# EAGLE design Rpi board 1 (EAGLE 7.3.0)
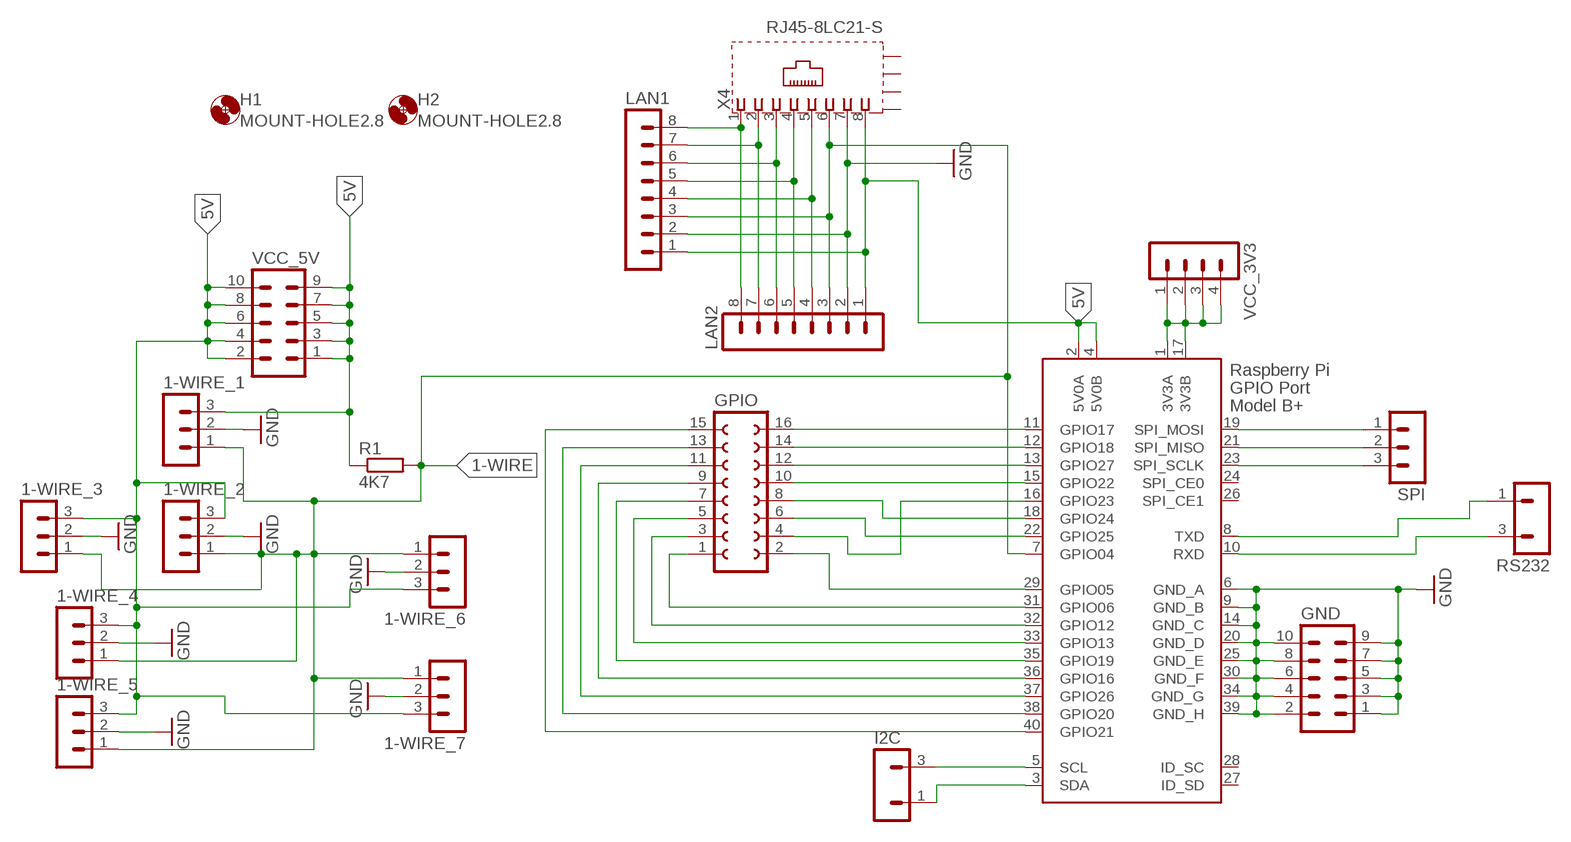
[diagram p0: schematic, sheet 1]

## Parts
1-WIRE_1  MA03-1  [MA03-1]
1-WIRE_2  MA03-1  [MA03-1]
1-WIRE_3  MA03-1  [MA03-1]
1-WIRE_4  MA03-1  [MA03-1]
1-WIRE_5  MA03-1  [MA03-1]
1-WIRE_6  MA03-1  [MA03-1]
1-WIRE_7  MA03-1  [MA03-1]
GND  MA05-2  [MA05-2]
GPIO  FE08-2  [FE08-2]
H1  MOUNT-HOLE2.8  [2,8]
H2  MOUNT-HOLE2.8  [2,8]
I2C  MA03-1  [MA03-1]
LAN1  MA08-1  [MA08-1]
LAN2  MA08-1  [MA08-1]
R1  4K7  R-EU_M0805  [M0805]
RS232  MA03-1  [MA03-1]
SPI  MA03-1  [MA03-1]
VCC_3V3  MA04-1  [MA04-1]
VCC_5V  MA05-2  [MA05-2]
X1  RASPI_GPIO_B+#_BOX  [RASPI_GPIO_B+_BOX]
X4  RJ45-8LC21-S  [RJ45-SHIELD1]

## Nets
1-WIRE: 1-WIRE_1.1 1-WIRE_2.1 1-WIRE_3.1 1-WIRE_4.1 1-WIRE_5.1 1-WIRE_6.1 1-WIRE_7.1 LAN1.3 LAN2.3 R1.2 X1.7(GPIO04) X4.6
5V: 1-WIRE_1.3 1-WIRE_2.3 1-WIRE_3.3 1-WIRE_4.3 1-WIRE_5.3 1-WIRE_6.3 1-WIRE_7.3 LAN1.1 LAN2.1 R1.1 VCC_5V.1 VCC_5V.2 VCC_5V.3 VCC_5V.4 VCC_5V.5 VCC_5V.6 VCC_5V.7 VCC_5V.8 VCC_5V.9 VCC_5V.10 X1.2(5V0A) X1.4(5V0B) X4.8
GND: 1-WIRE_1.2 1-WIRE_2.2 1-WIRE_3.2 1-WIRE_4.2 1-WIRE_5.2 1-WIRE_6.2 1-WIRE_7.2 GND.1 GND.2 GND.3 GND.4 GND.5 GND.6 GND.7 GND.8 GND.9 GND.10 LAN1.2 LAN2.2 X1.6(GND_A) X1.9(GND_B) X1.14(GND_C) X1.20(GND_D) X1.25(GND_E) X1.30(GND_F) X1.34(GND_G) X1.39(GND_H) X4.7
N$1: RS232.1 X1.8(TXD)
N$2: VCC_3V3.1 VCC_3V3.2 VCC_3V3.3 VCC_3V3.4 X1.1(3V3A) X1.17(3V3B)
N$3: RS232.3 X1.10(RXD)
N$4: SPI.1 X1.19(SPI_MOSI)
N$5: SPI.2 X1.21(SPI_MISO)
N$6: SPI.3 X1.23(SPI_SCLK)
N$7: I2C.3 X1.5(SCL)
N$8: I2C.1 X1.3(SDA)
N$9: GPIO.16 X1.11(GPIO17)
N$10: GPIO.14 X1.12(GPIO18)
N$11: GPIO.12 X1.13(GPIO27)
N$12: GPIO.10 X1.15(GPIO22)
N$13: GPIO.8 X1.18(GPIO24)
N$14: GPIO.6 X1.22(GPIO25)
N$15: GPIO.4 X1.16(GPIO23)
N$16: GPIO.2 X1.29(GPIO05)
N$17: GPIO.1 X1.31(GPIO06)
N$18: GPIO.3 X1.32(GPIO12)
N$19: GPIO.5 X1.33(GPIO13)
N$20: GPIO.7 X1.35(GPIO19)
N$21: GPIO.9 X1.36(GPIO16)
N$22: GPIO.11 X1.37(GPIO26)
N$23: GPIO.13 X1.38(GPIO20)
N$24: GPIO.15 X1.40(GPIO21)
N$28: LAN1.4 LAN2.4 X4.5
N$29: LAN1.5 LAN2.5 X4.4
N$30: LAN1.6 LAN2.6 X4.3
N$31: LAN1.7 LAN2.7 X4.2
N$32: LAN1.8 LAN2.8 X4.1
Unconnected: X1.24(SPI_CE0) X1.26(SPI_CE1) X1.27(ID_SD) X1.28(ID_SC) X4.S1(S) X4.S2(S) X4.S3(S) X4.S4(S)

## Library data of the parts
1-WIRE_1-1-WIRE_7 SPI = con-lstb:MA03-1: PIN HEADER; OC_FARNELL: unknown; OC_NEWARK: unknown
GND VCC_5V = con-lstb-wachcio:MA05-2: PIN HEADER; OC_FARNELL: unknown; OC_NEWARK: unknown
GPIO = con-lsta:FE08-2: FEMALE HEADER; OC_FARNELL: unknown; OC_NEWARK: unknown
H1 H2 = holes:MOUNT-HOLE: MOUNTING HOLE with drill center marker
I2C RS232 = con-lstb-wachcio:MA03-1: PIN HEADER; OC_FARNELL: unknown; OC_NEWARK: unknown
LAN1 LAN2 = con-lstb:MA08-1: PIN HEADER; OC_FARNELL: unknown; OC_NEWARK: unknown
R1 = rcl:R-EU_: RESISTOR, European symbol
VCC_3V3 = con-lstb-wachcio:MA04-1: PIN HEADER; OC_FARNELL: unknown; OC_NEWARK: unknown
X1 = raspberrypi_bastelstube_v13:RASPI_GPIO_B+#: 2x20 header connector, all pins connected
X4 = con-tycoelectronics:RJ45*2: RJ45 Low Profile Shield Type 2 For all RJ45 L, LC, LCT and X Series Models Source: www.tycoelectronics.com .. ENG_DS_1654001_1099_RJ_L_0507.pdf; OC_FARNELL: unknown; OC_NEWARK: unknown

## Board
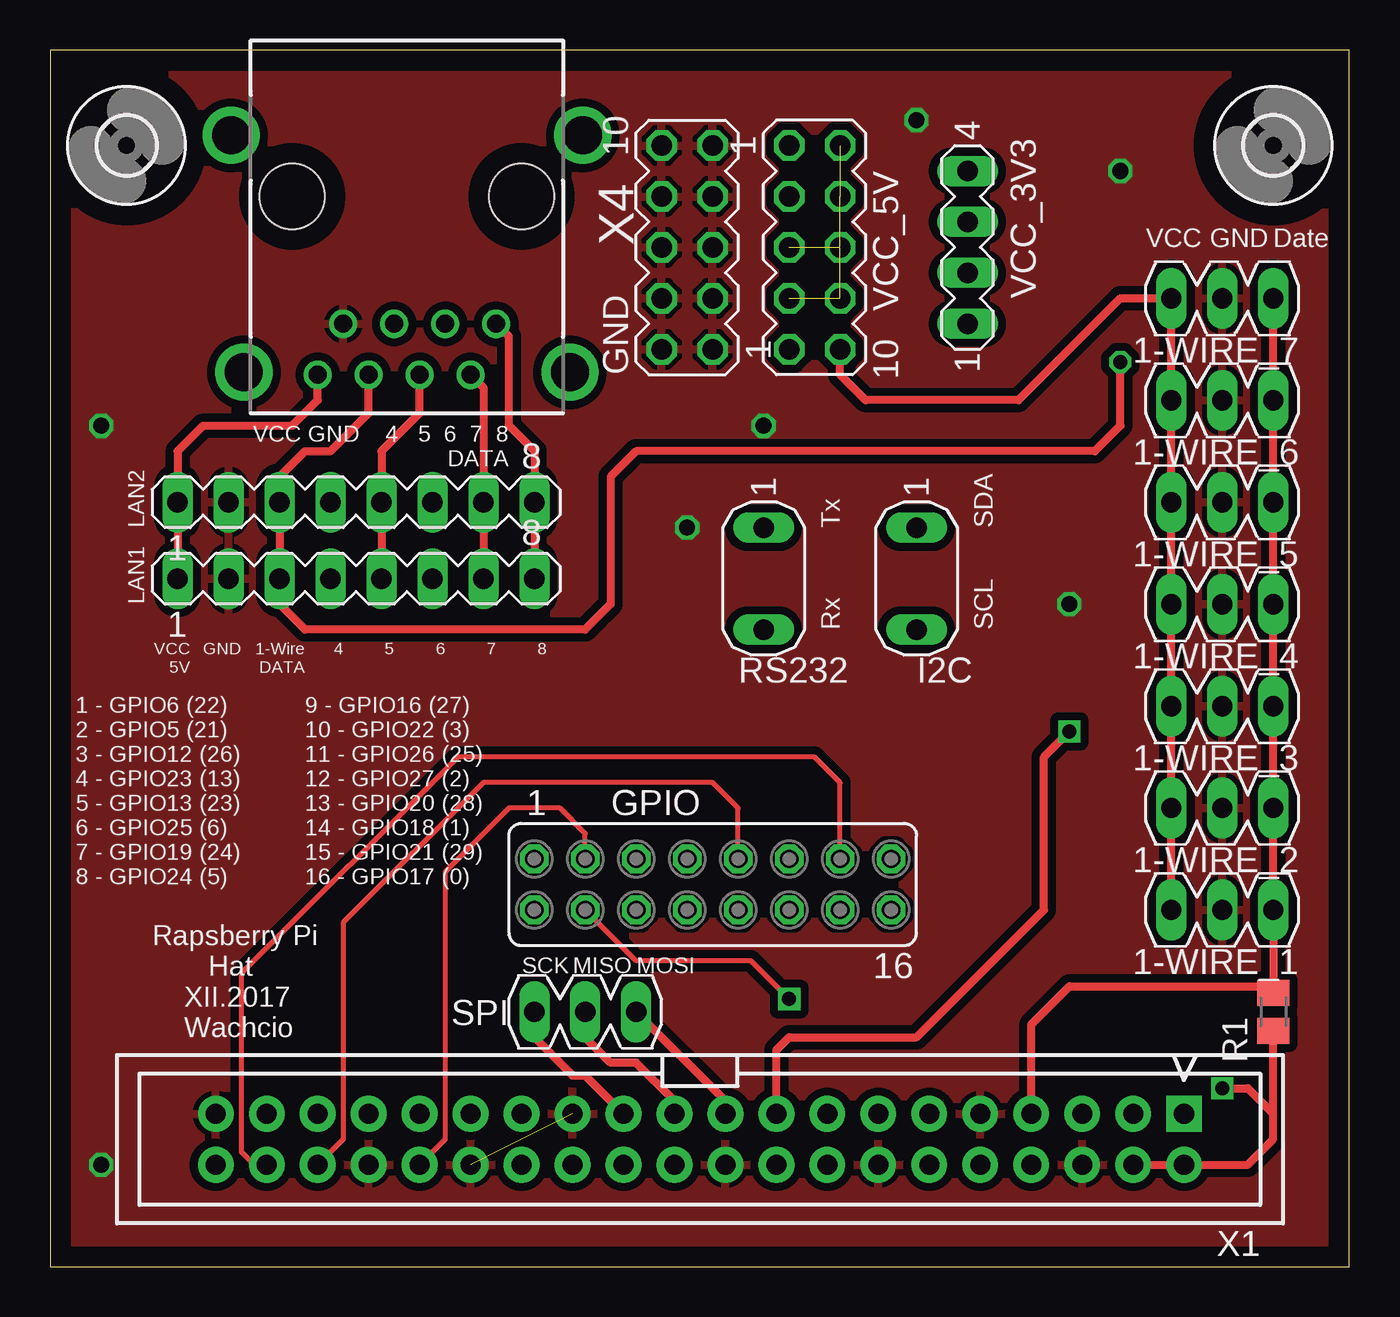
[diagram p1: board, top side]
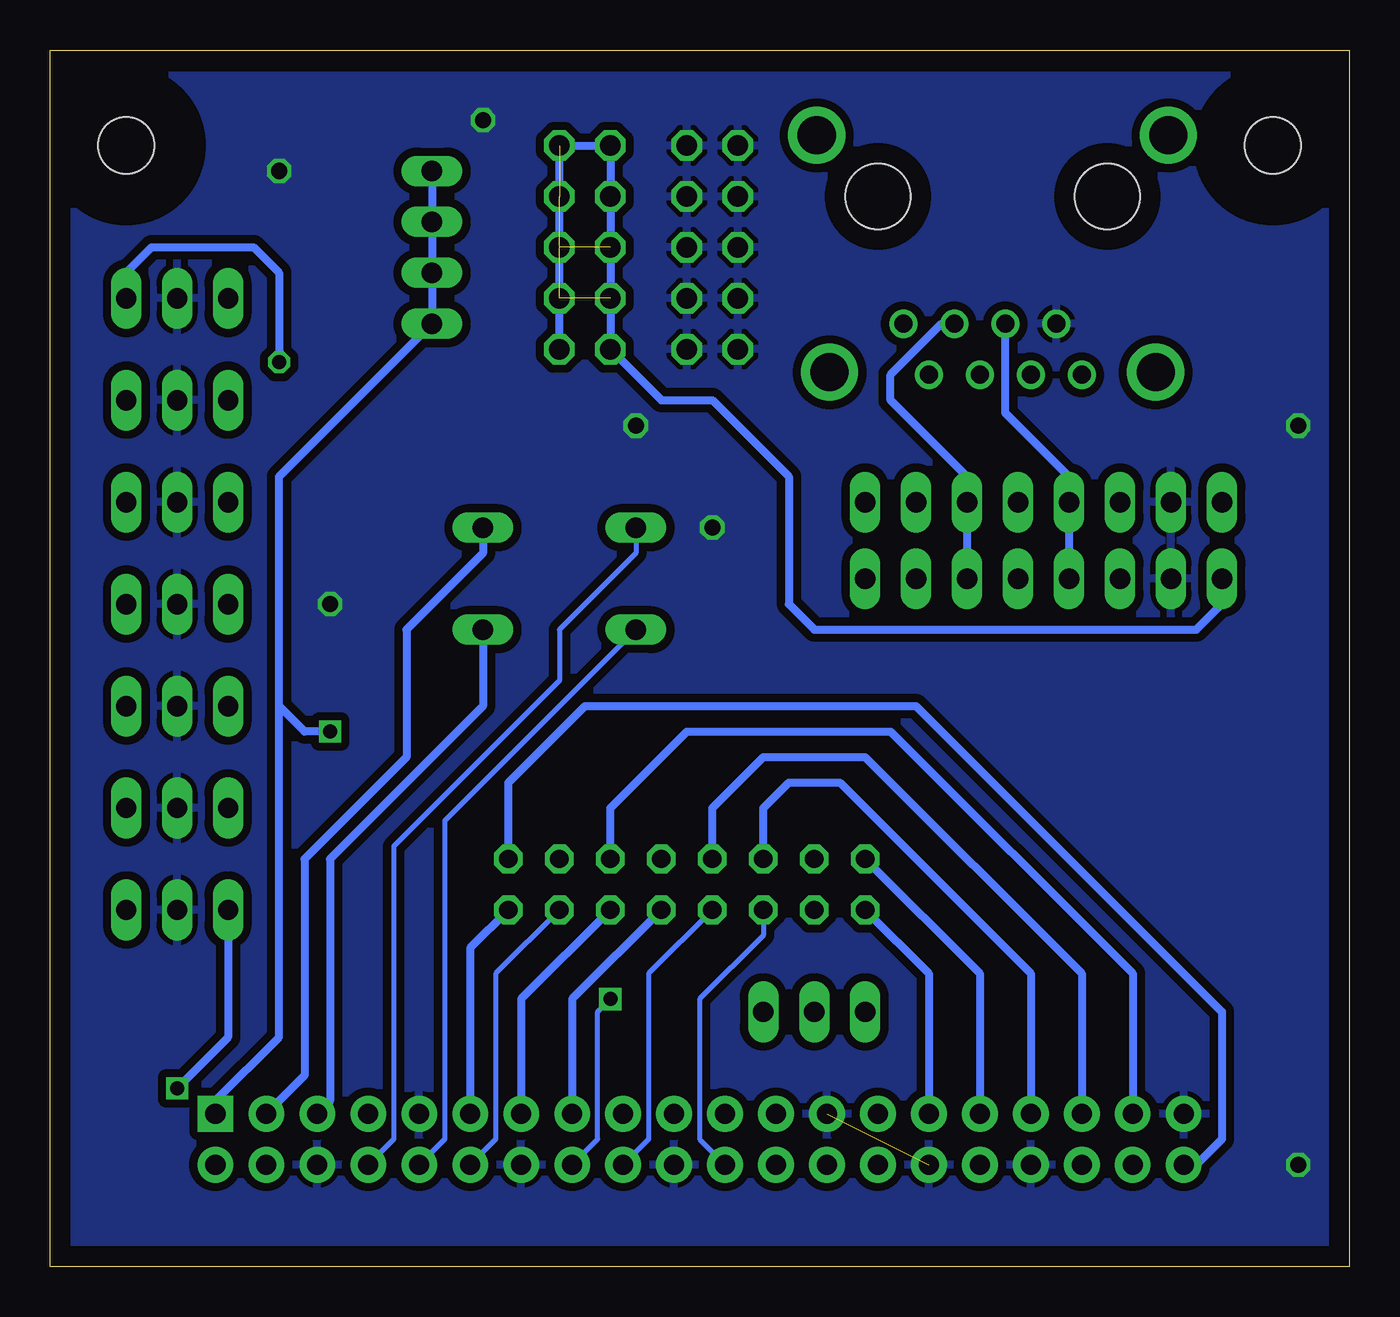
[diagram p2: board, bottom side, seen from below]

Size 64.75 x 60.63 mm. Coordinates in mm from the lower left corner, seen from the top.
Outline: 0,0 64.75,0 64.75,60.63 0,60.63 0,0
Copper layers (1*16): Top 0.035mm / dielectric 1.5mm / Bottom 0.035mm
Design rules "default": minimum track width 10mil, minimum drill 24mil, track to track 8mil, track to pad 8mil, pad to pad 8mil, via to via 8mil, smd to smd 8mil, copper to edge 40mil, drill to drill 8mil, minimum pad ring 10mil, minimum via ring 8mil, stop-mask expansion 4mil, vias tented up to drill 0mil, thermal gap 10mil

### Footprints (pad centres in the part's own frame; a part is rotated, then mirrored left to right if it is on the bottom)
MA03-1 = drill 1.016 long: 1 -2.54,0; 2 0,0; 3 2.54,0
MA05-2 = drill 1.016 octagon: 1 -5.08,-1.27; 2 -5.08,1.27; 3 -2.54,-1.27; 4 -2.54,1.27; 5 0,-1.27; 6 0,1.27; 7 2.54,-1.27; 8 2.54,1.27; 9 5.08,-1.27; 10 5.08,1.27
FE08-2 = drill 0.914 octagon: 1 -8.89,1.27; 2 -8.89,-1.27; 3 -6.35,1.27; 4 -6.35,-1.27; 5 -3.81,1.27; 6 -3.81,-1.27; 7 -1.27,1.27; 8 -1.27,-1.27; 9 1.27,1.27; 10 1.27,-1.27; 11 3.81,1.27; 12 3.81,-1.27; 13 6.35,1.27; 14 6.35,-1.27; 15 8.89,1.27; 16 8.89,-1.27
2,8 = hole 2.8: 0,0
MA03-1' = drill 1.016 long: 1 -2.54,0; 3 2.54,0
MA08-1 = drill 1.016 long: 1 -8.89,0; 2 -6.35,0; 3 -3.81,0; 4 -1.27,0; 5 1.27,0; 6 3.81,0; 7 6.35,0; 8 8.89,0
M0805 = smd 1.3 x 1.6: 1 -0.95,0; 2 0.95,0
MA04-1 = drill 1.016 long: 1 -3.81,0; 2 -1.27,0; 3 1.27,0; 4 3.81,0
RASPI_GPIO_B+_BOX = drill 1 pad 1.778 square: 1 -24.13,-1.27 | drill 1 pad 1.778: 2 -24.13,1.27; 3 -21.59,-1.27; 4 -21.59,1.27; 5 -19.05,-1.27; 6 -19.05,1.27; 7 -16.51,-1.27; 8 -16.51,1.27; 9 -13.97,-1.27; 10 -13.97,1.27; 11 -11.43,-1.27; 12 -11.43,1.27; 13 -8.89,-1.27; 14 -8.89,1.27; 15 -6.35,-1.27; 16 -6.35,1.27; 17 -3.81,-1.27; 18 -3.81,1.27; 19 -1.27,-1.27; 20 -1.27,1.27; 21 1.27,-1.27; 22 1.27,1.27; 23 3.81,-1.27; 24 3.81,1.27; 25 6.35,-1.27; 26 6.35,1.27; 27 8.89,-1.27; 28 8.89,1.27; 29 11.43,-1.27; 30 11.43,1.27; 31 13.97,-1.27; 32 13.97,1.27; 33 16.51,-1.27; 34 16.51,1.27; 35 19.05,-1.27; 36 19.05,1.27; 37 21.59,-1.27; 38 21.59,1.27; 39 24.13,-1.27; 40 24.13,1.27
RJ45-SHIELD1 = drill 0.9 pad 1.4: 1 -4.445,6.35; 2 -3.175,8.89; 3 -1.905,6.35; 4 -0.635,8.89; 5 0.635,6.35; 6 1.905,8.89; 7 3.175,6.35; 8 4.445,8.89 | drill 1.9 pad 2.5: S1 -8.763,-3.048; S2 8.763,-3.048; S3 -8.128,8.76; S4 8.128,8.76 | hole 3.251: -5.715,0; 5.715,0

### Placement (x,y rotation side)
1-WIRE_1  58.42,17.78 180 top
1-WIRE_2  58.42,22.86 180 top
1-WIRE_3  58.42,27.94 180 top
1-WIRE_4  58.42,33.02 180 top
1-WIRE_5  58.42,38.1 180 top
1-WIRE_6  58.42,43.18 180 top
1-WIRE_7  58.42,48.26 180 top
GND  31.75,50.8 90 top
GPIO  33.02,19.05 0 top
H1  60.96,55.88 0 top
H2  3.81,55.88 0 top
I2C  [MA03-1']  43.18,34.29 270 top
LAN1  15.24,34.29 0 top
LAN2  15.24,38.1 0 top
R1  60.96,12.7 90 top
RS232  [MA03-1']  35.56,34.29 270 top
SPI  26.67,12.7 180 top
VCC_3V3  45.72,50.8 90 top
VCC_5V  38.1,50.8 270 top
X1  32.38,6.35 180 top
X4  17.78,53.34 180 top

### Tracks (layer width: path | path; a pad name or v marks a point on that pad's centre or on a via)
1-WIRE  (via drill 0.7)
  Top 0.406: v53.34,45.09 53.34,41.91 52.07,40.64 29.21,40.64 27.94,39.37 27.94,33.02 26.67,31.75 12.7,31.75 11.43,33.02 LAN1.3 LAN2.3 11.43,39.37 12.7,40.64 13.97,40.64 15.88,42.55 X4.6 | 1-WIRE_7.1 1-WIRE_6.1 1-WIRE_5.1 1-WIRE_4.1 1-WIRE_3.1 1-WIRE_2.1 1-WIRE_1.1 R1.2 60.64,13.97 50.8,13.97 48.9,12.06 X1.7
  Bottom 0.406: 1-WIRE_7.1 60.96,49.53 59.69,50.8 54.61,50.8 53.34,49.53 v53.34,45.09
5V  (via drill 0.7)  (5 unrouted)
  Top 0.406: VCC_5V.10 39.37,44.45 40.64,43.18 48.26,43.18 53.34,48.26 1-WIRE_7.3 1-WIRE_6.3 1-WIRE_5.3 1-WIRE_4.3 1-WIRE_3.3 1-WIRE_2.3 1-WIRE_1.3 | X1.4 X1.2 59.69,5.08 60.96,6.35 60.96,7.62 | 60.96,7.62 R1.1 | v58.42,8.89 59.69,8.89 60.96,7.62 | X4.8 13.34,43.18 12.06,41.91 7.62,41.91 6.35,40.64 LAN2.1 LAN1.1
  Bottom 0.406: VCC_5V.10 VCC_5V.2 VCC_5V.1 VCC_5V.3 VCC_5V.9 34.29,43.18 31.75,43.18 27.94,39.37 27.94,33.02 26.67,31.75 7.62,31.75 6.35,33.02 LAN1.1 | 1-WIRE_1.3 55.88,11.43 v58.42,8.89
GND  (via drill 0.8)  (1 unrouted)
  other vias: 31.75,36.83 2.54,41.91 53.34,54.61 2.54,5.08 35.56,41.91 50.8,33.02 43.18,57.15
  pour Bottom (isolate 0.406): 0,0 64.77,0 64.77,59.69 0,59.69
  pour Top (isolate 0.406): 0,0 64.77,0 64.77,59.69 0,59.69
N$1
  Bottom 0.254: RS232.1 35.56,35.56 39.37,31.75 39.37,29.21 47.62,20.95 47.62,6.35 X1.8
N$2  (via drill 0.7)
  Top 0.406: X1.17 36.2,10.79 36.83,11.43 43.18,11.43 49.53,17.78 49.53,25.4 v50.8,26.67
  Bottom 0.406: VCC_3V3.4 VCC_3V3.3 VCC_3V3.2 VCC_3V3.1 53.34,39.37 53.34,27.94 | X1.1 56.52,8.26 53.34,11.43 53.34,27.94 | 53.34,27.94 52.07,26.67 v50.8,26.67
N$3
  Bottom 0.254: RS232.3 45.09,22.23 45.09,6.35 X1.10
N$4
  Top 0.406: X1.19 33.66,8.26 SPI.1
N$5
  Top 0.406: X1.21 31.11,8.26 29.21,10.16 27.94,10.16 26.67,11.43 SPI.2
N$6
  Top 0.406: SPI.3 24.13,11.43 26.04,9.53 26.67,9.53 X1.23
N$7
  Bottom 0.406: I2C.3 43.18,27.94 50.8,20.32 50.8,8.26 X1.5
N$8
  Bottom 0.406: I2C.1 43.18,35.56 46.99,31.75 46.99,25.4 52.07,20.32 52.07,9.53 X1.3
N$9
  Bottom 0.406: GPIO.16 43.81,15.88 X1.11
N$10
  Bottom 0.254: GPIO.14 42.55,14.61 42.55,6.35 X1.12
N$11
  Bottom 0.406: GPIO.12 41.27,13.34 X1.13
N$12
  Bottom 0.406: GPIO.10 38.73,13.34 X1.15
N$13
  Bottom 0.254: GPIO.8 34.92,14.61 34.92,6.35 X1.18
N$14
  Bottom 0.254: GPIO.6 29.21,16.51 32.38,13.34 32.38,6.35 X1.22
N$15  (via drill 0.7)
  Top 0.254: GPIO.4 29.21,15.24 34.92,15.24 v36.83,13.34
  Bottom 0.254: X1.16 37.47,6.35 37.47,12.7 v36.83,13.34
N$16
  Bottom 0.406: GPIO.2 20.95,14.61 X1.29
N$17
  Bottom 0.406: GPIO.1 18.41,14.61 X1.31
N$18
  Top 0.254: GPIO.3 26.67,21.59 25.4,22.86 22.86,22.86 19.68,19.68 19.68,6.35 X1.32
N$19
  Bottom 0.406: GPIO.5 29.21,22.86 27.94,24.13 25.4,24.13 15.88,14.61 X1.33
N$20
  Bottom 0.406: GPIO.7 31.75,22.86 29.21,25.4 24.13,25.4 13.34,14.61 X1.35
N$21
  Top 0.254: GPIO.9 34.29,22.86 33.02,24.13 21.59,24.13 14.61,17.14 14.61,6.35 X1.36
N$22
  Bottom 0.406: GPIO.11 36.83,22.86 33.02,26.67 22.86,26.67 10.79,14.61 X1.37
N$23
  Top 0.254: GPIO.13 39.37,24.13 38.1,25.4 20.32,25.4 9.53,14.61 9.53,5.71 10.16,5.08 X1.38
N$24
  Bottom 0.406: GPIO.15 41.91,24.13 38.1,27.94 21.59,27.94 6.35,12.7 6.35,6.35 7.62,5.08 X1.40
N$28
  Bottom 0.406: X4.5 17.14,42.55 13.97,39.37 LAN2.4 LAN1.4
N$29
  Top 0.406: X4.4 18.41,42.55 16.51,40.64 LAN2.5 LAN1.5
N$30
  Bottom 0.406: X4.3 20.32,46.99 22.86,44.45 22.86,43.18 19.05,39.37 LAN2.6 LAN1.6
N$31
  Top 0.406: X4.2 21.59,43.81 LAN2.7 LAN1.7
N$32
  Top 0.406: X4.1 22.86,46.35 22.86,41.91 24.13,40.64 LAN2.8 LAN1.8

### Text on the board
tNames: VCC | GND | Date | VCC GND 4 5 6 7 8 / DATA | Tx | SDA | Rx | SCL | VCC / 5V | GND | 1-Wire / DATA | 4 | 5 | 6 | 7 | 8 | 1 - GPIO6 (22) / 2 - GPIO5 (21) / 3 - GPIO12 (26) / 4 - GPIO23 (13) / 5 - GPIO13 (23) / 6 - GPIO25 (6) / 7 - GPIO19 (24) / 8 - GPIO24 (5) | 9 - GPIO16 (27) / 10 - GPIO22 (3) / 11 - GPIO26 (25) / 12 - GPIO27 (2) / 13 - GPIO20 (28) / 14 - GPIO18 (1) / 15 - GPIO21 (29) / 16 - GPIO17 (0) | SCK | MISO | MOSI | Rapsberry Pi / Hat / XII.2017 / Wachcio